# EAGLE design emonVS_mini (EAGLE 9.6.2)
AUTHOR: OpenEnergyMonitor; IGNORE_RENUMBER: F;RV; SOURCE: github.com/openenergymonitor/emonVoltageSense; VERSION: 1.3.2
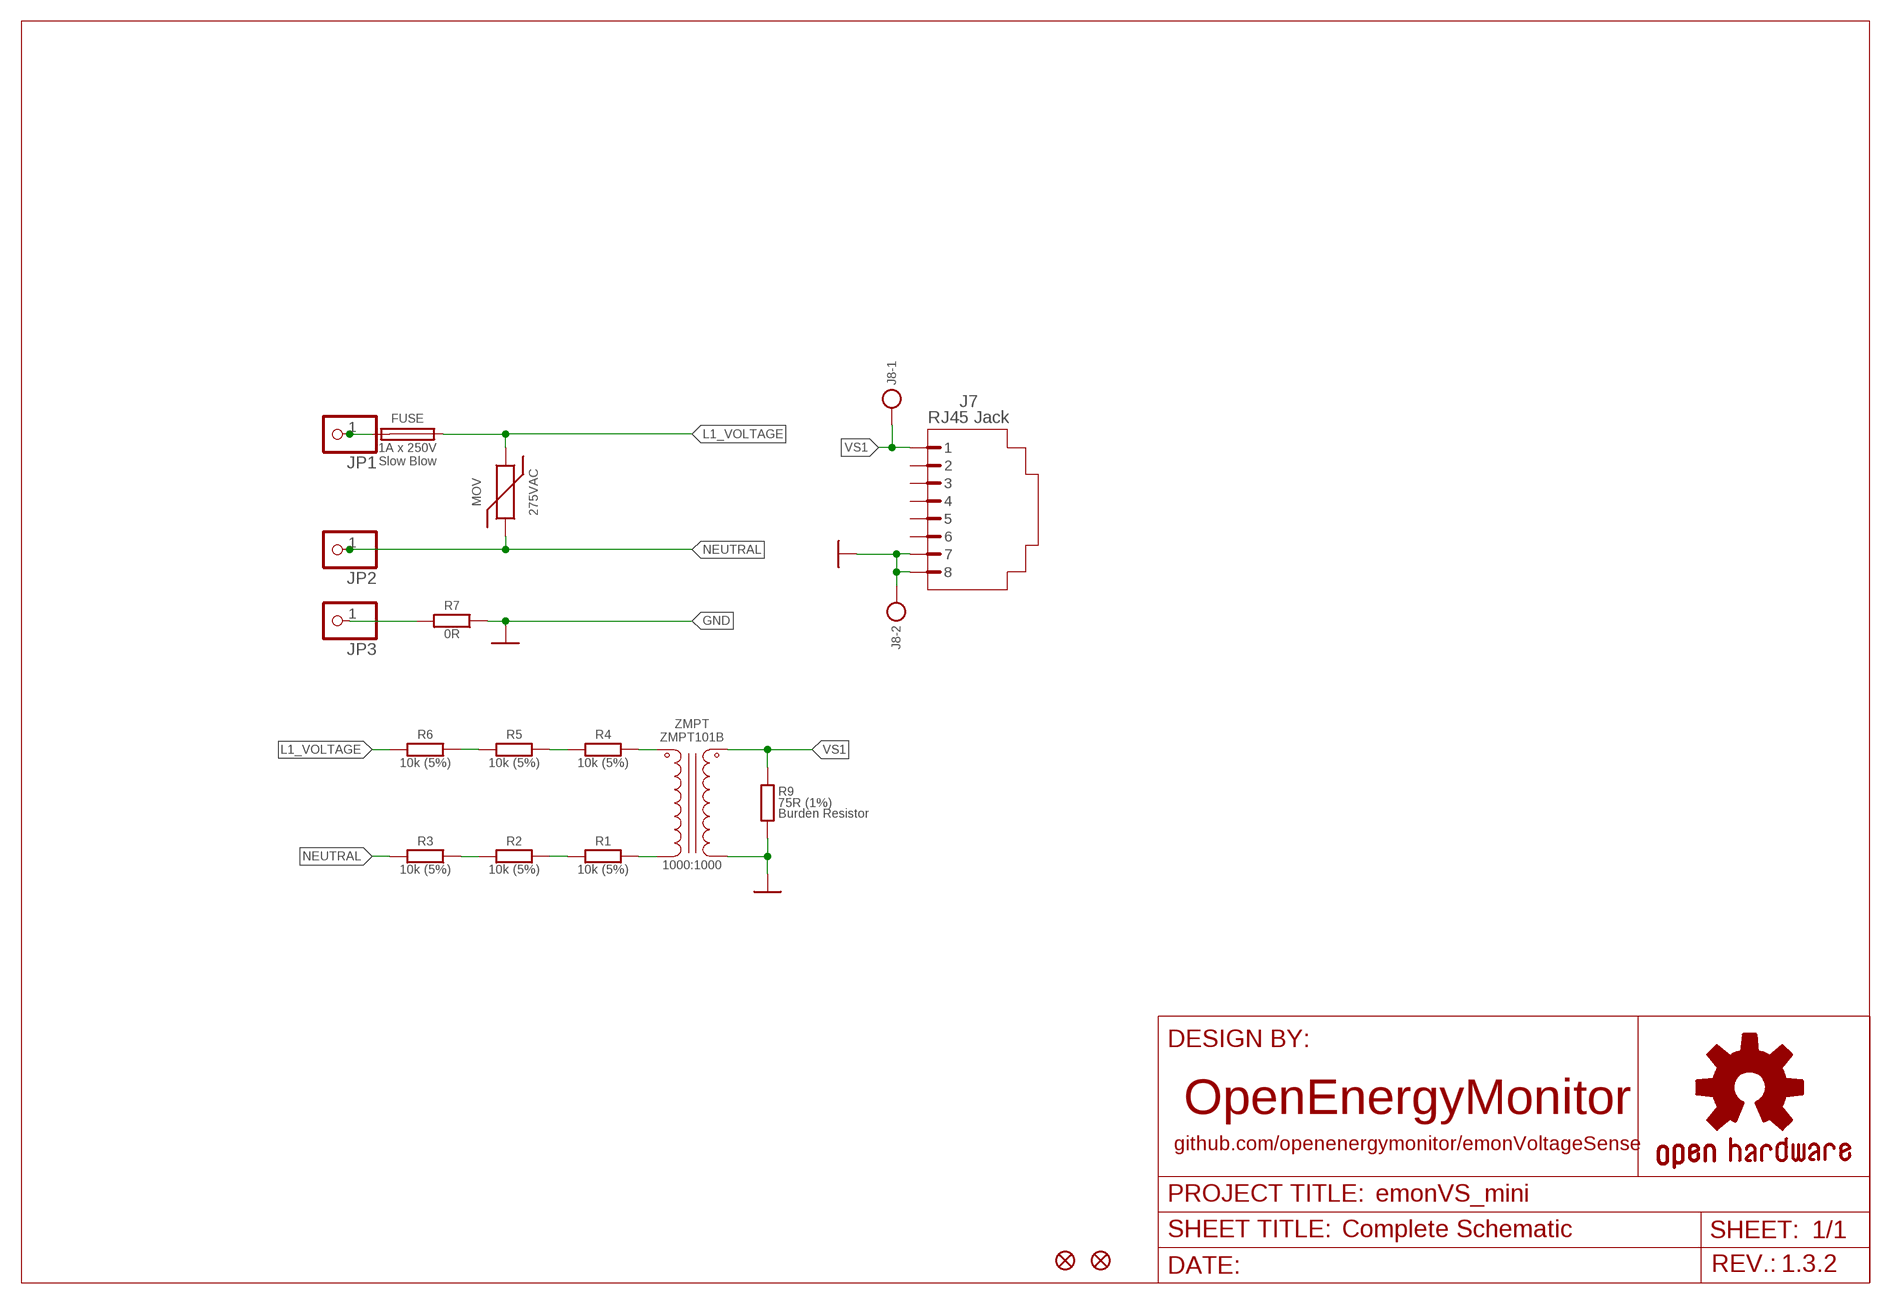
[diagram p0: schematic, sheet 1]

## Parts
FD1  FIDUCIAL1X2  [FIDUCIAL]
FD2  FIDUCIAL1X2  [FIDUCIAL]
FUSE  1A x 250V  FUSE  [FUSE]
J7  RJ45 Jack  RJ45-8PPTH  [RJ45-8P]
J8  TERMINAL_BLOCK_2P  [TERMINAL_BLOCK_2P]
JP1  PINHD-1X1  [1X01]
JP2  PINHD-1X1  [1X01]
JP3  PINHD-1X1  [1X01]
MOV  275VAC  MOV_14MM_275VAC  [MOV]
R1  10k (5%)  R_1206  [R1206]
R2  10k (5%)  R_1206  [R1206]
R3  10k (5%)  R_1206  [R1206]
R4  10k (5%)  R_1206  [R1206]
R5  10k (5%)  R_1206  [R1206]
R6  10k (5%)  R_1206  [R1206]
R7  0R  R_1206  [R1206]
R9  75R (1%)  R_  [R_PTH_SMD]
ZMPT  ZMPT101B  [ZMPT101B]

## Nets
GND: J7.7 J7.8 J8.1 R7.1 R9.1A R9.1B ZMPT.4(SEC_1) ; supply symbol labelled 0V
L1_VOLTAGE: FUSE.OUT MOV.1 R6.2
N$1: R4.1 ZMPT.2(PRI_1)
N$2: R1.1 ZMPT.1(PRI_2)
N$3: R1.2 R2.1
N$4: R4.2 R5.1
N$5: R5.2 R6.1
N$6: R2.2 R3.1
N$7: FUSE.IN JP1.1
N$8: JP3.1 R7.2
NEUTRAL: JP2.1 MOV.2 R3.2
VS1: J7.1 J8.2 R9.2A R9.2B ZMPT.3(SEC_2)
Unconnected: J7.2 J7.3 J7.4 J7.5 J7.6

## Library data of the parts
FD1 FD2 = OpenEnergyMonitor:FIDUCIAL: Fiducial Alignment Points Point-of-reference for pick-and-place machines and other optical instruments.
FUSE = OpenEnergyMonitor:FUSE; FAMILY: Slow Blow; PN: MST 1A 250V
J7 = OpenEnergyMonitor:RJ45-8P: RJ45 Jack Simple RJ45, 8-pin connection - connector for common Cat5, Cat5e, and Cat6 Ethernet cables. Footprint not yet proven in production. Connector sku is PRT-00643; Breakout PCB sku is BOB-00716.; PN: PRT-00643
J8 = OpenEnergyMonitor:TERMINAL_BLOCK_2P: TE Connectivity - Fixed Terminal Blocks Number of Positions: 2 Position Pitch: 5 mm Connection Method: Screw Clamp Current Rating: 13.5 A Voltage Rating: 300 V Wire Gauge Min: 30 AWG Wire Gauge Max: 16 AWG; PN: 282836-2
JP1-JP3 = adafruit:PINHD-1X1: Pin header 1x1 for 0.1" spacing With round pins
MOV = OpenEnergyMonitor:MOV_: MOV - Metal-Oxide Varistor; PN: MOV-14D431KTR
R1-R7 = My-RLC:R_: RESISTOR; PN: ERJ-H3GJ103V
R9 = OpenEnergyMonitor:R_: Burden Resistors This footprint supports SMD 0603 package and PTH 0204 package.; DESCRIPTION: Burden Resistor; PN: ERJ-H3EF75R0V
ZMPT = OpenEnergyMonitor:ZMPT101B: Current-type Voltage Transformer Source: Datasheet; PN: ZMPT101B; RATIO: 1000:1000

## Net classes
0 default: clearance 0.205 mm
1 power: width 0.305 mm, drill 0.6 mm, clearance 0.254 mm
2 gnd: width 0.254 mm, drill 0.6 mm, clearance 0.254 mm

## Board
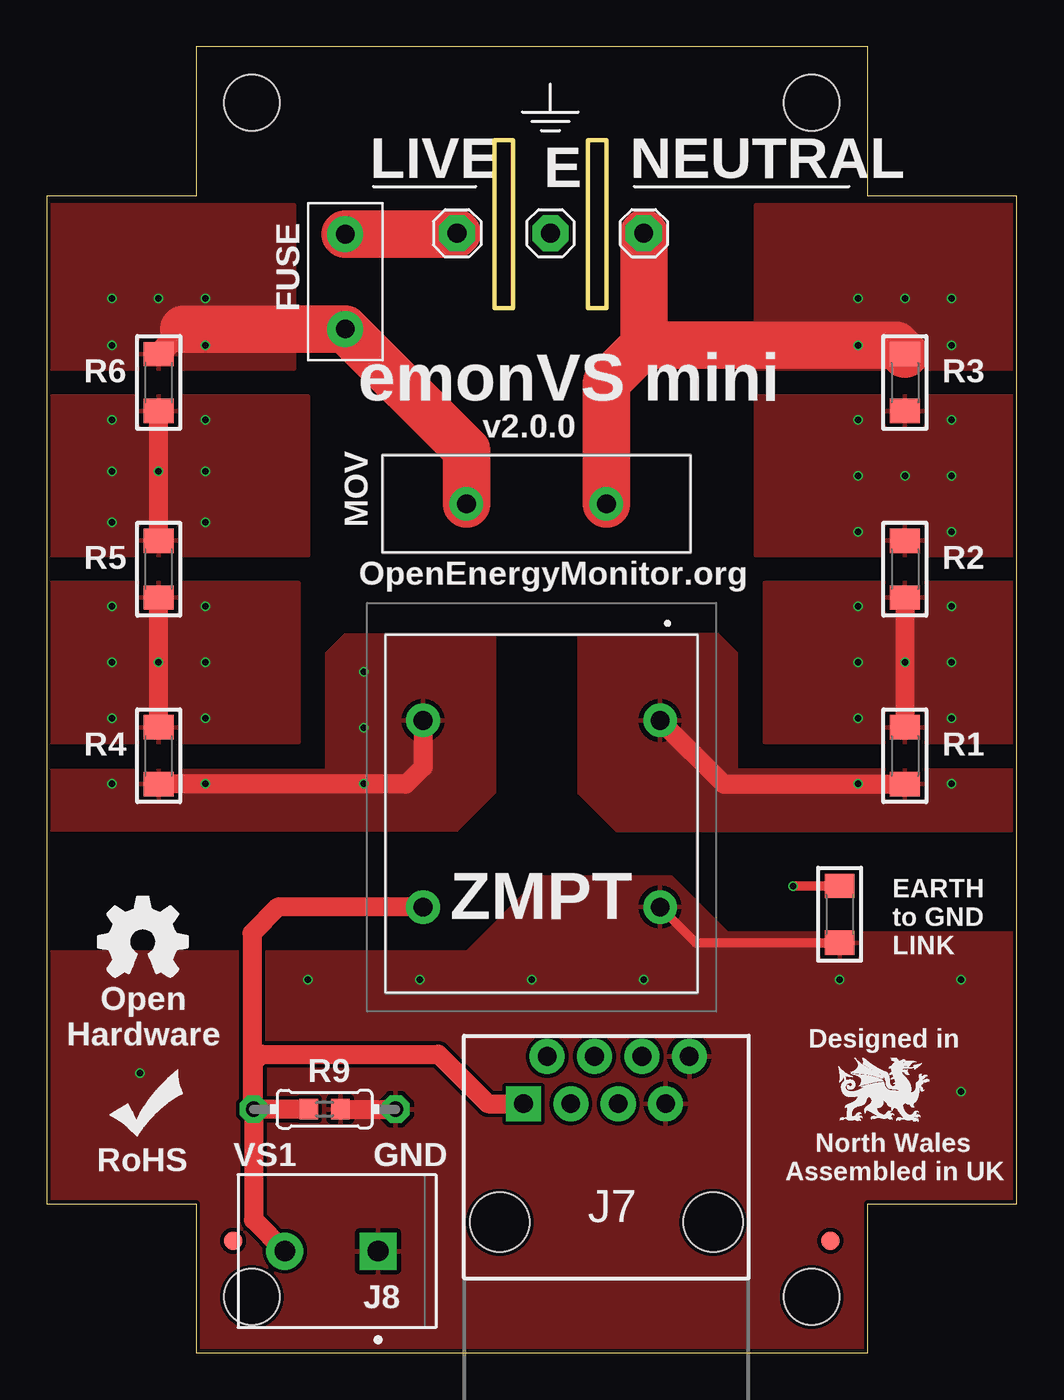
[diagram p1: board, top side]
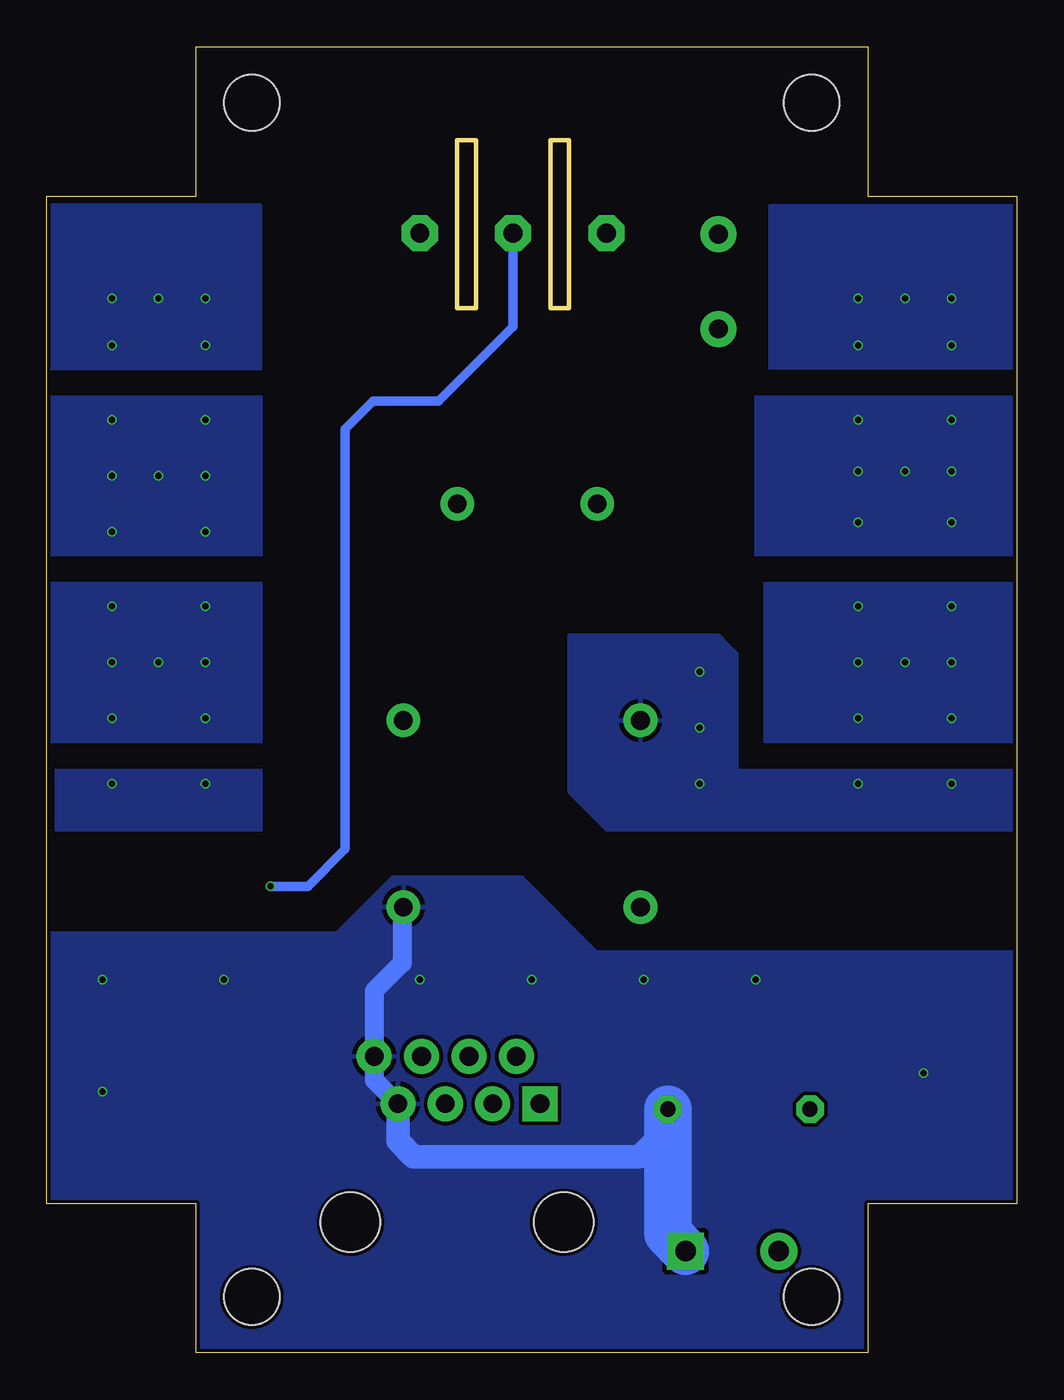
[diagram p2: board, bottom side, seen from below]

Size 52 x 70 mm. Coordinates in mm from the lower left corner, seen from the top.
Outline: 0,8 8,8 8,0 44,0 44,8 52,8 52,62 44,62 44,70 8,70 8,62 0,62 0,8
Copper layers (1*16): Top 0.035mm / dielectric 1.6mm / Bottom 0.035mm
Design rules "jlcpcb-2layers *": minimum track width 5mil, minimum drill 0.3mm, track to track 5mil, track to pad 5mil, pad to pad 5mil, via to via 5mil, smd to smd 5mil, copper to edge 0.2mm, drill to drill 6mil, minimum pad ring 10mil, minimum via ring 3mil, stop-mask expansion 4mil, vias tented up to drill 14mil, thermal gap 10mil
Holes 3 mm at 11,3 41,3 11,67 41,67
Milling: 8 lines

### Footprints (pad centres in the part's own frame; a part is rotated, then mirrored left to right if it is on the bottom)
FIDUCIAL = smd 1 x 1: 1 0,0
FUSE = drill 1 pad 1.93: IN 2,1.66; OUT 2,6.74
RJ45-8P = drill 1 pad 1.88 square: 1 -4.445,6.35 | drill 1 pad 1.88: 2 -3.175,8.89; 3 -1.905,6.35; 4 -0.635,8.89; 5 0.635,6.35; 6 1.905,8.89; 7 3.175,6.35; 8 4.445,8.89 | hole 3.2: -5.715,0; 5.715,0
TERMINAL_BLOCK_2P = drill 1.1 pad 1.6 square: 1 -2.5,0 | drill 1.1 pad 1.6: 2 2.5,0
1X01 = drill 1.016 pad 1.93 octagon: 1 0,0
MOV = drill 1 pad 1.5: 1 0,0; 2 7.5,0
R1206 = smd 1.3 x 1.6: 1 -1.524,0; 2 1.524,0
R_PTH_SMD = drill 0.813 octagon: 1A -3.81,0; 2A 3.81,0 | smd 1 x 1.1: 1B -0.85,0; 2B 0.85,0
ZMPT101B = drill 1 pad 1.5: 1 0,0; 2 0,-12.7; 3 10,-12.7; 4 10,0

### Placement (x,y rotation side)
FD1  10,6 0 top
FD2  42,6 0 top
FUSE  18,61.61 180 top
J7  30,7 0 top
J8  15.26,5.45 180 top
JP1  22,60 0 top
JP2  32,60 0 top
JP3  27,60 0 top
MOV  22.5,45.5 0 top
R1  46,32 90 top
R2  46,42 90 top
R3  46,52 90 top
R4  6,32 90 top
R5  6,42 90 top
R6  6,52 90 top
R7  42.5,23.5 90 top
R9  14.9,13.06 180 top
ZMPT  32.88,33.89 270 top

### Tracks (layer width: path | path; a pad name or v marks a point on that pad's centre or on a via)
GND  (via drill 0.35)
  Top 0.508: R7.1 34.79,21.98 ZMPT.4
  Top 1.016: R9.1B R9.1A
  Bottom 1.016: J7.7 34.45,14.62 J7.8 34.45,19.39 32.95,20.89 32.95,23.82 ZMPT.4
  Bottom 1.27: R9.1A 18.71,12.06 20.27,10.5 32.33,10.5 33.17,11.35 J7.7
  Bottom 2.54: R9.1A 18.71,6.39 J8.1
  other vias: 42.5,20 49,20 49,14 5,15 14,20 20,20 26,20 32,20
  pour Top: 20.5,21.5 -0.5,21.5 -0.5,7.5 7.5,7.5 7.5,-0.5 44.5,-0.5 44.5,7.5 52.5,7.5 52.5,22.5 36.5,22.5 33.5,25.5 26.5,25.5 22.5,21.5
  pour Bottom: -1,21.5 22.5,21.5 26.5,25.5 33.5,25.5 36.5,22.5 51.5,22.5 52.5,22.5 52.5,7.5 44.5,7.5 44.5,-0.5 7.5,-0.5 7.5,7.5 -0.5,7.5 -1,7.5
L1_VOLTAGE  (via drill 0.35)
  Top 1.27: R6.2 7.35,54.87
  Top 2.54: MOV.1 22.5,48.37 FUSE.OUT 7.35,54.87
  other vias: 3.5,54 3.5,56.5 6,56.5 8.5,56.5 8.5,54
  pour Top: -0.5,61.5 -0.5,52.75 13.25,52.75 13.25,61.5
  pour Bottom: -0.25,61.5 -0.25,52.75 13.25,52.75 13.25,61.5
N$1  (via drill 0.35)
  Top 1.016: ZMPT.2 20.18,31.39 19.26,30.48 R4.1
  other vias: 3.5,30.5 8.5,30.5 17,30.5 17,33.5 17,36.5
  pour Top: -0.5,31.25 15,31.25 15,37.5 16,38.5 24,38.5 24,30 22,28 -0.5,28
  pour Bottom: -0.25,31.25 -0.25,28 22,28 24,30 24,38.5 16,38.5 15,37.5 15,31.25
N$2  (via drill 0.35)
  Top 1.016: ZMPT.1 36.29,30.48 R1.1
  other vias: 43.5,30.5 48.5,30.5
  pour Top: 28.5,38.5 28.5,30 30.5,28 52.5,28 52.5,31.25 37,31.25 37,37.5 36,38.5
  pour Bottom: 40.5,31.25 40.5,28 51.5,28 51.5,31.25
N$3  (via drill 0.35)
  Top 1.016: R2.1 R1.2
  other vias: 43.5,40 48.5,40 48.5,37 46,37 43.5,37 43.5,34 48.5,34
  pour Top: 38.5,32.75 53,32.75 53,41.25 38.5,41.25
  pour Bottom: 40.5,41.25 40.5,32.75 52.75,32.75 52.75,41.25
N$4  (via drill 0.35)
  Top 1.016: R4.2 R5.1
  other vias: 3.5,40 8.5,40 8.5,37 6,37 3.5,37 3.5,34 8.5,34
  pour Top: -0.5,41.25 13.5,41.25 13.5,32.75 -0.5,32.75
  pour Bottom: -0.25,41.25 -0.25,32.75 13.5,32.75 13.5,41.25
N$5  (via drill 0.35)
  Top 1.016: R5.2 R6.1
  other vias: 3.5,44.5 3.5,47.25 8.5,47.25 8.5,44.5 3.5,50 8.5,50 6,47.25
  pour Top: -0.5,51.25 14,51.25 14,42.75 -0.5,42.75
  pour Bottom: -0.25,51.25 -0.25,42.75 14,42.75 14,51.25
N$6  (via drill 0.35)
  other vias: 43.5,50 48.5,50 48.5,44 43.5,44 43.5,47 48.5,47 46,47
  pour Top: 38,51.25 38,42.75 53,42.75 53,51.25
  pour Bottom: 40.5,51.25 40.5,42.75 52.75,42.75 52.75,51.25
N$7
  Top 2.54: JP1.1 21.95,59.95 FUSE.IN
N$8  (via drill 0.35)
  Top 0.508: R7.2 40.02,25.02 v40,25
  Bottom 0.508: JP3.1 27,55 31,51 34.5,51 36,49.5 36,27 38,25 v40,25
NEUTRAL  (via drill 0.35)
  Top 2.54: MOV.2 30,52 32,54 | R3.2 45.52,54 v43.5,54 32,54 | JP2.1 32,54
  other vias: 48.5,54 48.5,56.5 46,56.5 43.5,56.5
  pour Top: 38,52.75 53,52.75 53,61.5 38,61.5
  pour Bottom: 52.75,61.5 52.75,52.75 40.5,52.75 40.5,61.5
VS1
  Top 1.016: R9.2B R9.2A | R9.2A 11.09,7.13 J8.2 | R9.2A 11.09,15.56 11.53,16 21,16 23.65,13.35 J7.1 | ZMPT.3 12.39,23.89 11,22.5 11,13.14 R9.2A

### Text on the board
tPlace: emonVS mini | v2.0.0 | OpenEnergyMonitor.org | EARTH / to GND / LINK | Open / Hardware | Designed in | North Wales | RoHS | Assembled in UK
tNames: LIVE | NEUTRAL | E | FUSE | https://www.farnell.com/datasheets/1964085.pdf / / Consider PSU, Block VB 0.35/1/6 TF01286 / / Consider C8 connector CN21956 / / 10k 1206 0.1% resistors: / TNPW120610K0BEEA | VS1 | GND | J7